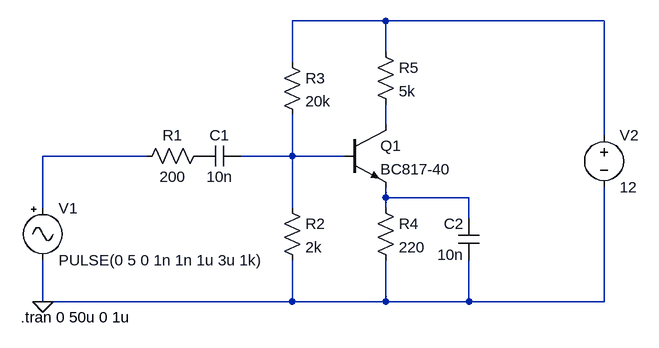
[diagram p0: schematic NPN_amp.asc]
NPN_amp.asc, the LTspice schematic file:
Version 4
SHEET 1 952 680
WIRE 560 -144 416 -144
WIRE 896 -144 560 -144
WIRE 560 -96 560 -144
WIRE 416 -80 416 -144
WIRE 560 16 560 -16
WIRE 896 32 896 -144
WIRE 192 64 32 64
WIRE 416 64 416 0
WIRE 416 64 336 64
WIRE 496 64 416 64
WIRE 560 128 560 112
WIRE 688 128 560 128
WIRE 32 144 32 64
WIRE 416 144 416 64
WIRE 560 144 560 128
WIRE 688 160 688 128
WIRE 32 288 32 224
WIRE 416 288 416 224
WIRE 416 288 32 288
WIRE 560 288 560 224
WIRE 560 288 416 288
WIRE 688 288 688 224
WIRE 688 288 560 288
WIRE 896 288 896 112
WIRE 896 288 688 288
FLAG 32 288 0
SYMBOL Misc\\signal 32 128 R0
WINDOW 123 0 0 Left 0
WINDOW 39 0 0 Left 0
SYMATTR InstName V1
SYMATTR Value PULSE(0 5 0 1n 1n 1u 3u 1k)
SYMBOL res 288 48 R90
WINDOW 0 0 56 VBottom 2
WINDOW 3 32 56 VTop 2
SYMATTR InstName R1
SYMATTR Value 200
SYMBOL cap 336 48 R90
WINDOW 0 0 32 VBottom 2
WINDOW 3 32 32 VTop 2
SYMATTR InstName C1
SYMATTR Value 10n
SYMBOL npn 496 16 R0
SYMATTR InstName Q1
SYMATTR Value BC817-40
SYMBOL res 400 128 R0
SYMATTR InstName R2
SYMATTR Value 2k
SYMBOL res 400 -96 R0
SYMATTR InstName R3
SYMATTR Value 20k
SYMBOL res 544 128 R0
SYMATTR InstName R4
SYMATTR Value 220
SYMBOL voltage 896 16 R0
WINDOW 123 0 0 Left 0
WINDOW 39 0 0 Left 0
SYMATTR InstName V2
SYMATTR Value 12
SYMBOL res 544 -112 R0
SYMATTR InstName R5
SYMATTR Value 5k
SYMBOL cap 704 224 R180
WINDOW 0 24 56 Left 2
WINDOW 3 24 8 Left 2
SYMATTR InstName C2
SYMATTR Value 10n
TEXT -2 312 Left 2 !.tran 0 50u 0 1u

The netlist it stands for:
* NPN_amp.asc
V1 N003 0 PULSE(0 5 0 1n 1n 1u 3u 1k)
R1 P001 N003 200
C1 N004 P001 10n
Q1 N002 N004 N005 0 BC817-40
R2 N004 0 2k
R3 N001 N004 20k
R4 N005 0 220
V2 N001 0 12
R5 N001 N002 5k
C2 0 N005 10n
.model NPN NPN
.model PNP PNP
.lib standard.bjt
.tran 0 50u 0 1u
.backanno
.end